# Altium schematic sheet Sheet1.SchDoc: Launch Controller
size B; DrawnBy: Erich Robb; DocumentNumber: 1669-1759-R001; Revision: A; SheetNumber: 1; SheetTotal: 2
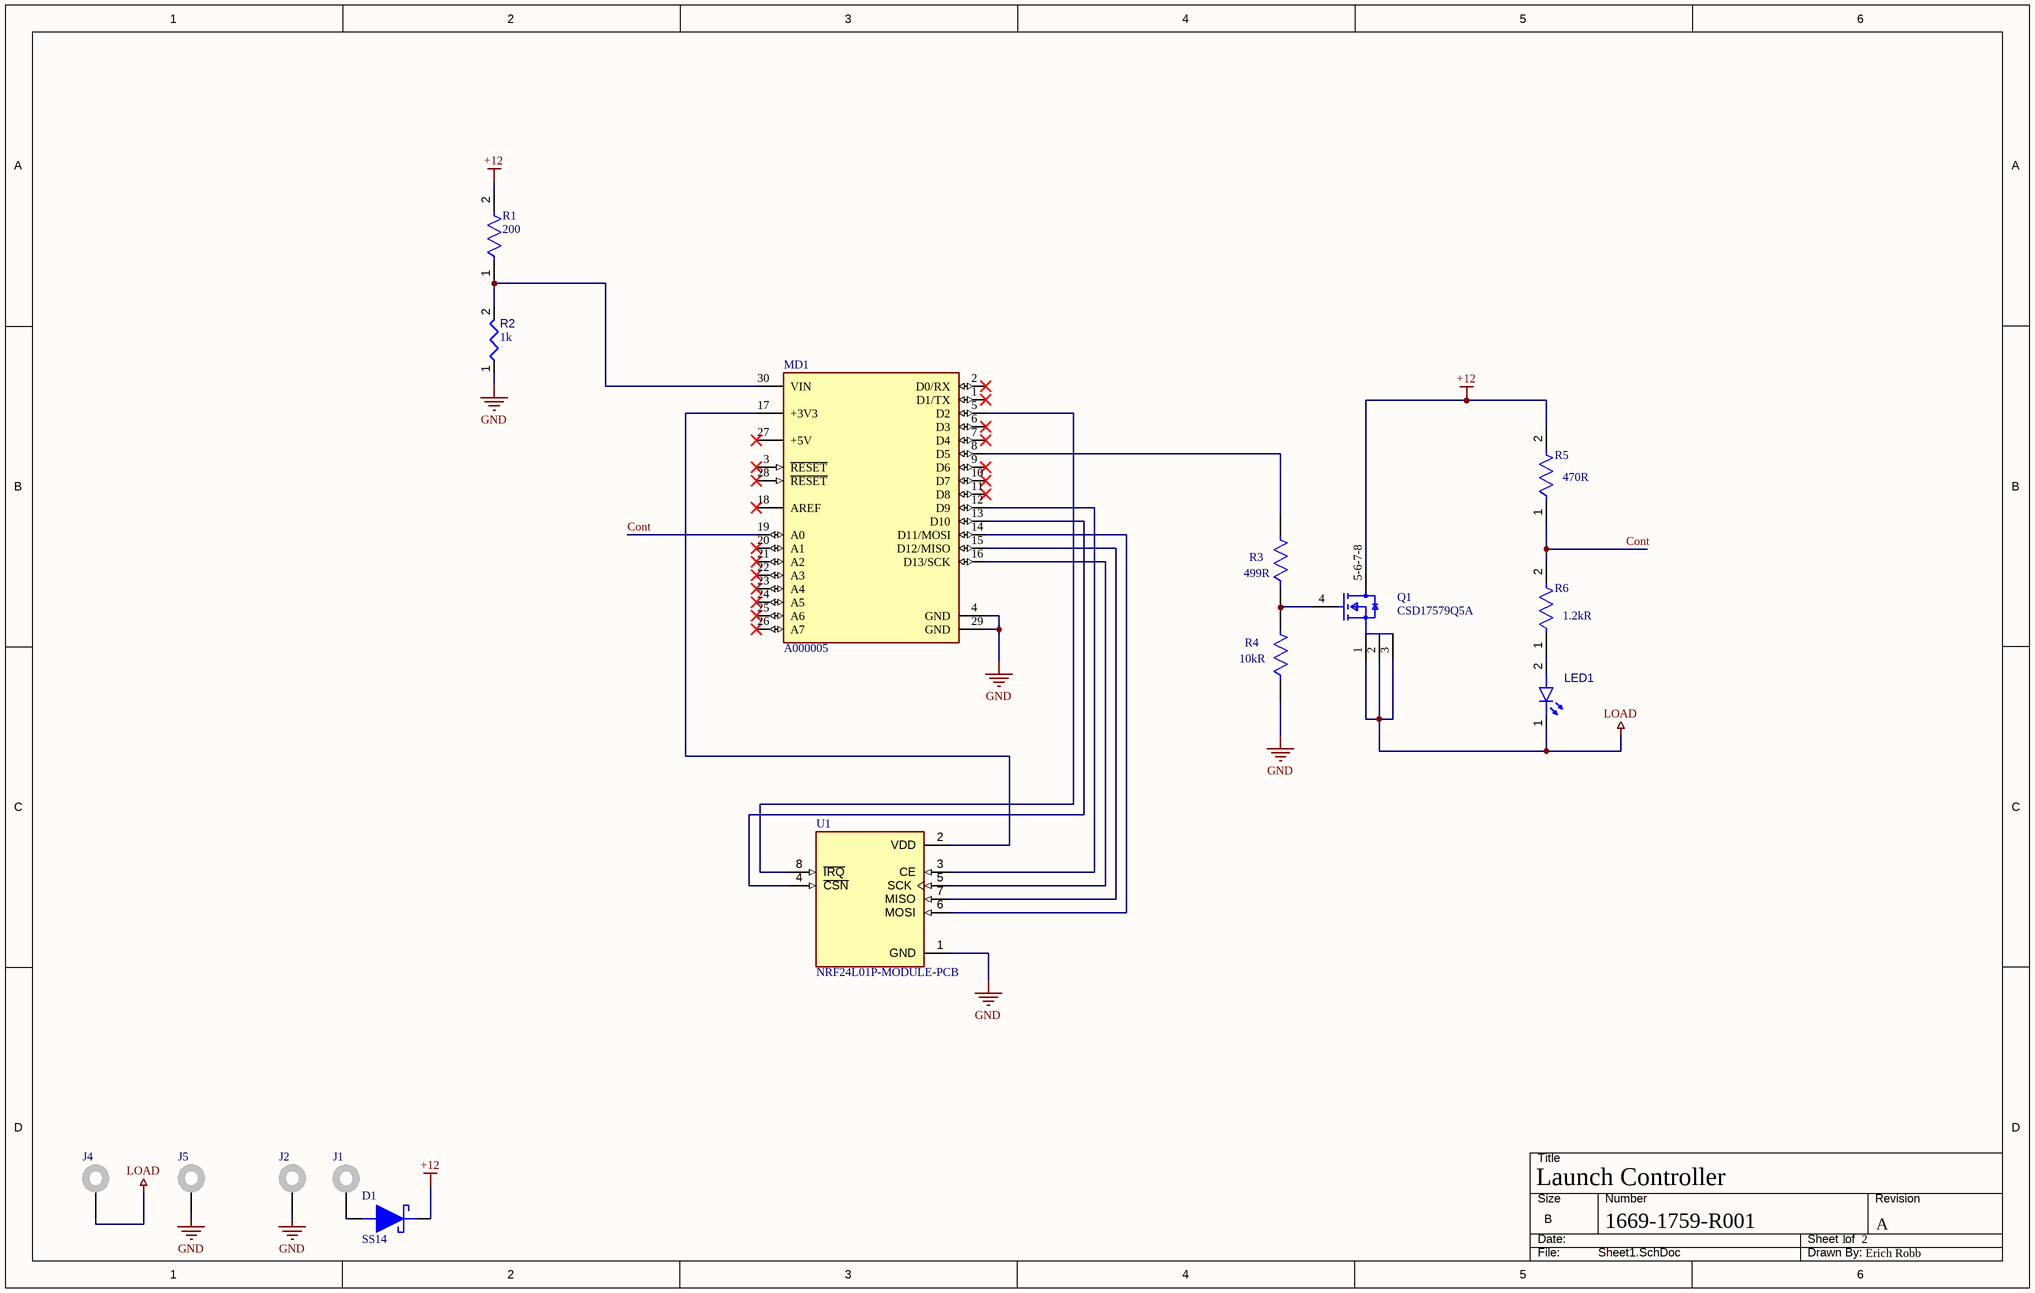
[diagram p0: Sheet1.SchDoc]

## Parts
D1  SS14  [DIOM5227X270N]
J1  575-8  [KSTN-575-8]  (value not drawn)
J2  575-8  [KSTN-575-8]  (value not drawn)
J4  575-8  [KSTN-575-8]  (value not drawn)
J5  575-8  [KSTN-575-8]  (value not drawn)
LED1  QBLP595-IB  [QTB-QBLP595_V]  (value not drawn)
MD1  A000005  [FP-A000005-MFG]
Q1  CSD17579Q5A  [FP-DQJ0008A-MFG]
R1  value 200  [FP-RC3216-IPC_A]  (hidden comment: RC3216F201CS)
R2  value 1k  [FP-MCA1206-IPC_A]  (hidden comment: MCA12060C1001FP500)
R3  value 499R  [FP-RT1206-MFG]  (hidden comment: RT1206FRE07499RL)
R4  Resistance: 10kR  [FP-CRCW1206-e3-IPC_C]  (hidden comment: CRCW120610K0FKEA)
R5  Resistance: 470R  [FP-CRCW1206-e3-IPC_A]  (hidden comment: CRCW1206470RJNEA)
R6  Resistance: 1.2kR  [FP-RC3216-IPC_A]  (hidden comment: RC3216J122CS)
U1  NRF24L01P-MODULE-PCB  [XCVR_NRF24L01P-MODULE-PCB]

## Nets
+12: D1.1(K) Q1.5-6-7-8(D) R1.2 R5.2
GND: J2.1 J5.1 MD1.4(GND) MD1.29(GND) R2.1 R4.1 U1.1(GND)
LOAD: J4.1 LED1.1(K) Q1.1(S) Q1.2(S) Q1.3(S)
Cont: MD1.19(A0) R5.1 R6.2
NetD1_2: D1.2(A) J1.1
NetLED1_2: LED1.2(A) R6.1
NetMD1_5: MD1.5(D2) U1.8(~{IRQ})
NetMD1_8: MD1.8(D5) R3.2
NetMD1_12: MD1.12(D9) U1.3(CE)
NetMD1_13: MD1.13(D10) U1.4(~{CSN})
NetMD1_14: MD1.14(D11/MOSI) U1.6(MOSI)
NetMD1_15: MD1.15(D12/MISO) U1.7(MISO)
NetMD1_16: MD1.16(D13/SCK) U1.5(SCK)
NetMD1_17: MD1.17(+3V3) U1.2(VDD)
NetMD1_30: MD1.30(VIN) R1.1 R2.2
NetQ1_4: Q1.4(G) R3.1 R4.2

Not connected (* = marked no-connect by the designer): MD1 1(D1/TX)* 2(D0/RX)* 3(~{RESET})* 6(D3)* 7(D4)* 9(D6)* 10(D7)* 11(D8)* 18(AREF)* 20(A1)* 21(A2)* 22(A3)* 23(A4)* 24(A5)* 25(A6)* 26(A7)* 27(+5V)* 28(~{RESET})*

## Library data of the parts
D1 = CMP-004-00031-2: Diode Schottky 40 V 1A Surface Mount DO-214AC (SMA); MF: ON Semiconductor; SnapEDA_Link: https://www.snapeda.com/parts/SS14/Onsemi/view-part/?ref=snap; Pins: 2; Case/Package: SMA-2 ON Semiconductor; Check_prices: https://www.snapeda.com/parts/SS14/Onsemi/view-part/?ref=eda; MP: SS14; Design Item ID: SS14; Source: SS14.SchLib; Component Type: Standard; Value: *
J1 J2 J4 J5 = CMP-1672-00007-5: Non-Insulated Jack, Through Hole, RoHS, Bulk; Manufacturer: Keystone; PackageDescription: 1-Pin Through Hole Device, Dia 7.92 mm; PackageReference: 575-8; ComponentLink1Description: Manufacturer URL; Mounting Technology: Through Hole; ComponentLink2URL: http://www.keyelco.com/product-pdf.cfm?p=2379; ComponentLink2Description: Datasheet; DatasheetVersion: Rev. B, 11/1994; ComponentLink1URL: http://www.keyelco.com/
LED1 = CMP-007-00042-3: Chip LED 0402, Blue, 0.02 A, 3.1 to 3.7 V, -40 to 80 degC, 2-Pin SMD, RoHS, Tape and Reel; RoHS Compliant: Yes; Colour: Blue; Pins: 2; Case/Package: 0402; Mounting Technology: SMT
MD1 = CMP-189986-000002-1: ARDUINO NANO ATMEGA328 EVAL BRD; Number of Bits: 8; Evaluation Kit: Yes; Operating Supply Voltage: 12V; Interface: I2C; Data Bus Width: 8b; Core Architecture: AVR; Packaging: Bulk; Length: 7inch; Package Quantity: 50; Width: 5inch; REACH SVHC: No SVHC; Weight: 0.358383oz; Series: AVR® ATmega; Height: 0.25inch
Q1 = CMP-013-00034-3: 30V, N ch NexFET MOSFET, single SON5x6, 13.3mOhm 8-VSONP; MF: Texas Instruments; Terminal Finish: Tin; Purchase-URL: https://pricing.snapeda.com/search/part/CSD17579Q5A/?ref=eda; JESD-609 Code: e3; Check_prices: https://www.snapeda.com/parts/CSD17579Q5A/Texas+Instruments/view-part/?ref=eda; Pins: 8; Design Item ID: CSD17579Q5A; Price: None; Value: *; Component Type: Standard; MP: CSD17579Q5A; Moisture Sensitivity Level: 1; Case/Package: VSONP-8 Texas Instruments; Source: CSD17579Q5A.SchLib; Peak Reflow Temperature (Cel): 260°C; SnapEDA_Link: https://www.snapeda.com/parts/CSD17579Q5A/Texas+Instruments/view-part/?ref=snap; Reach SVHC Compliant: No; Availability: In Stock; RoHS Compliant: Yes
R1 = CMP-009-00180-1: Fixed Resistor, Metal Glaze/thick Film, 0.25W, 200ohm, 200V, 1% +/-Tol, 100ppm/Cel, Surface Mount, 1206; Power: 250mW; Max Operating Temperature: 155°C; Case/Package: 1206; Mounting Technology: Surface Mount; Min Operating Temperature: -55°C; RoHS Compliant: Yes; Pins: 2; Tolerance: 1%
R2 = CMP-009-00181-2: Fixed Resistor, Thin Film, 0.25W, 1000ohm, 200V, 1% +/-Tol, 50ppm/Cel, Surface Mount, 1206; Power: 250mW; RoHS Compliant: Yes; Min Operating Temperature: -55°C; Max Operating Temperature: 125°C; Mounting Technology: Surface Mount; Case/Package: 1206; Pins: 2; Tolerance: 1%
R3 = CMP-2003-04117-2: RES SMD 499 OHM 1% 1/4W 1206; Manufacturer: Yageo; Voltage Rating: 200V; Tolerance: 0.0002; Resistance: 499Ω; Temperature Coefficient: 50 ppm/°C; Power Rating: 0.25W; Manufacturer Part Number: RT1206FRE07499RL; Temperature Range Low: -55°C; ComponentLink2URL: http://www.yageo.com/documents/recent/PYu-RT_1-to-0.01_RoHS_L_9.pdf; Footprint Url: http://www.yageo.com/exep/pages/download/literatures/PYu-R_Mount_10.pdf; Series: RT; ComponentLink2Description: Datasheet; Temperature: -55°C to +155°C; Package: RT1206; Temperature Range High: +155°C; Digikey Description: RES SMD 499 OHM 1% 1/4W 1206; Category: Res; Lead Free: Yes; Mouser Description: Res SMD 499 Ohm 1% 1/8W 1206; Ipc Land Pattern Name: RESC310160X55; Composition: Thin Film; Device Class L3: Chip SMD Resistors; Automotive: No; RoHS: TRUE; Device Class L1: Passive Components; Height: 0.65mm; Octopart: https://octopart.com/rt1206fre07499rl-yageo-1402563; Device Class L2: Resistors
R4 = CMP-2003-04807-2: RES Thick Film, 10kΩ, 1%, 0.25W, 100ppm/°C, 1206; Working Voltage: 200V; Max Power Dissipation: 250mW; Tolerance: 1%; Width: 0.063inch; Height: 0.55mm; Number of Pins: 2; Voltage Rating: 200V; Temperature Coefficient: 100ppm/°C; Military Standard: Not; Features: Automotive AEC-Q200; Depth: 1.6mm; Radiation Hardening: No; Termination: SMD/SMT; Case Code (Imperial): 1206; Weight: 0.000353oz; Length: 3.2mm; Package Quantity: 10; Voltage Rating (DC): 200V; Case/Package: 1206; Min Operating Temperature: -55°C; Number of Terminations: 2; Composition: Thick Film; Contact Plating: Tin; Power Rating: 250mW; Packaging: Tape and Reel; Max Operating Temperature: 155°C; Lead Free: Lead Free; Case Code (Metric): 3216
R5 = CMP-2003-02207-2: RES Thick Film, 470Ω, 5%, 0.25W, 200ppm/°C, 1206; Voltage Rating: 200V; Power Rating: 250mW; Lead Free: Lead Free; Width: 1.6mm; Contact Plating: Tin; Termination: SMD/SMT; Military Standard: Not; Temperature Coefficient: 200ppm/°C; Height: 0.55mm; Case Code (Imperial): 1206; Composition: Thick Film; Min Operating Temperature: -55°C; Weight: 0.000353oz; Radiation Hardening: No; Length: 3.2mm; Tolerance: 5%; Packaging: Tape and Reel; Voltage Rating (DC): 200V; Max Operating Temperature: 155°C; Package Quantity: 5000; Case/Package: 1206; Case Code (Metric): 3216; Depth: 1.6mm
R6 = CMP-13261-002668-1: Res Thick Film 1206 1.2kΩ 5% 0.25W ±100ppm/°C Molded SMD T/R; Max Power Dissipation: 250mW; Length: 3.2mm; Tolerance: 5%; Features: Moisture Resistant; Depth: 1.6mm; Temperature Coefficient: 100ppm/°C; Width: 0.063inch; Radiation Hardening: No; Military Standard: Not; Contact Plating: Tin; Composition: Thick Film; Min Operating Temperature: -55°C; Number of Terminations: 2; Packaging: Tape and Reel; Case Code (Imperial): 1206; Height: 0.026inch; Max Operating Temperature: 155°C; Case/Package: 1206; Case Code (Metric): 3216
U1 = CMP-005-000000-1: - Transceiver For Use With nRF24L01+; MF: Nordic Semiconductor; Component Type: Standard; Pin Count: 8; Source: NRF24L01P-MODULE-PCB.SchLib; Value: *; Design Item ID: NRF24L01P-MODULE-PCB; Mouser-Purchase-URL: https://snapeda.com/shop?store=Mouser&id=230534; Availability: Bad; Package: None; Price: None; SnapEDA_Link: https://www.snapeda.com/parts/NRF24L01P-MODULE-PCB/Nordic%20Semiconductor%20ASA/view-part/230534/?ref=snap; MP: NRF24L01P-MODULE-PCB